# Altium schematic sheet Sheet3-can.SchDoc
size A4; SheetNumber: 4; SheetTotal: 4
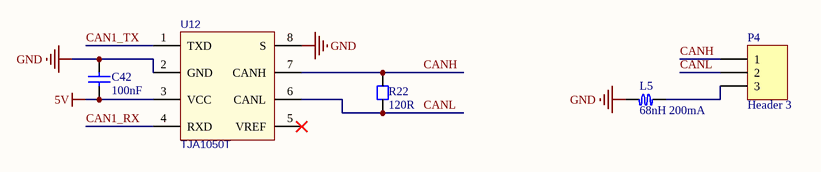
[diagram p0: Sheet3-can.SchDoc]

## Parts
C42  100nF  [CC1608-0603]
L5  68nH 200mA  [Inductor-0603]
P4  Header 3  [HX2.54-3]
R22  120R  [CR1608-0603]
U12  TJA1050T  [SOIC-8]

## Nets
5V: C42.1 U12.3(VCC)
GND: C42.2 L5.2 U12.2(GND) U12.8(S)
CAN1_RX: U12.4(RXD)
CAN1_TX: U12.1(TXD)
CANH: P4.1 R22.2 U12.7(CANH)
CANL: P4.2 R22.1 U12.6(CANL)
NetL5_1: L5.1 P4.3

Not connected (* = marked no-connect by the designer): U12 5(VREF)*

## Library data of the parts
C42 = Cap Chip 0603: 0603封装的电容; Published: 8-Jun-2000; Revision: July-2002: Re-released for DXP Platform.; Publisher: Altium Limited
L5 = Inductor-0603: 贴片电感 0603封装
P4 = Header 3: Header, 3-Pin; LatestRevisionDate: 17-Jul-2002; LatestRevisionNote: Re-released for DXP Platform.; Publisher: Altium Limited
R22 = Resistor Chip 0603: 0603封装电阻; Published: 8-Jun-2000; Revision: July-2002: Re-released for DXP Platform.; Publisher: Altium Limited
U12 = TJA1050T: 1Mhz Can芯片，兼容3.3~5V设备; BOM_Manufacturer: NXP(恩智浦); BOM_Manufacturer Part: TJA1050T/CM,118; BOM_Supplier: LCSC; BOM_Supplier Part: C6952; BOM_JLCPCB Part Class: Basic Part; spicePre: U; spiceSymbolName: TJA1050T/CM,118